# EasyEDA schematic phantom_sch.json
TITLE: Adaptador NES - Phantom; REV: 1.0; Date: 2025-06-09; Sheet: 1/1; Drawn By: robertofelix; Company: AidentuNet
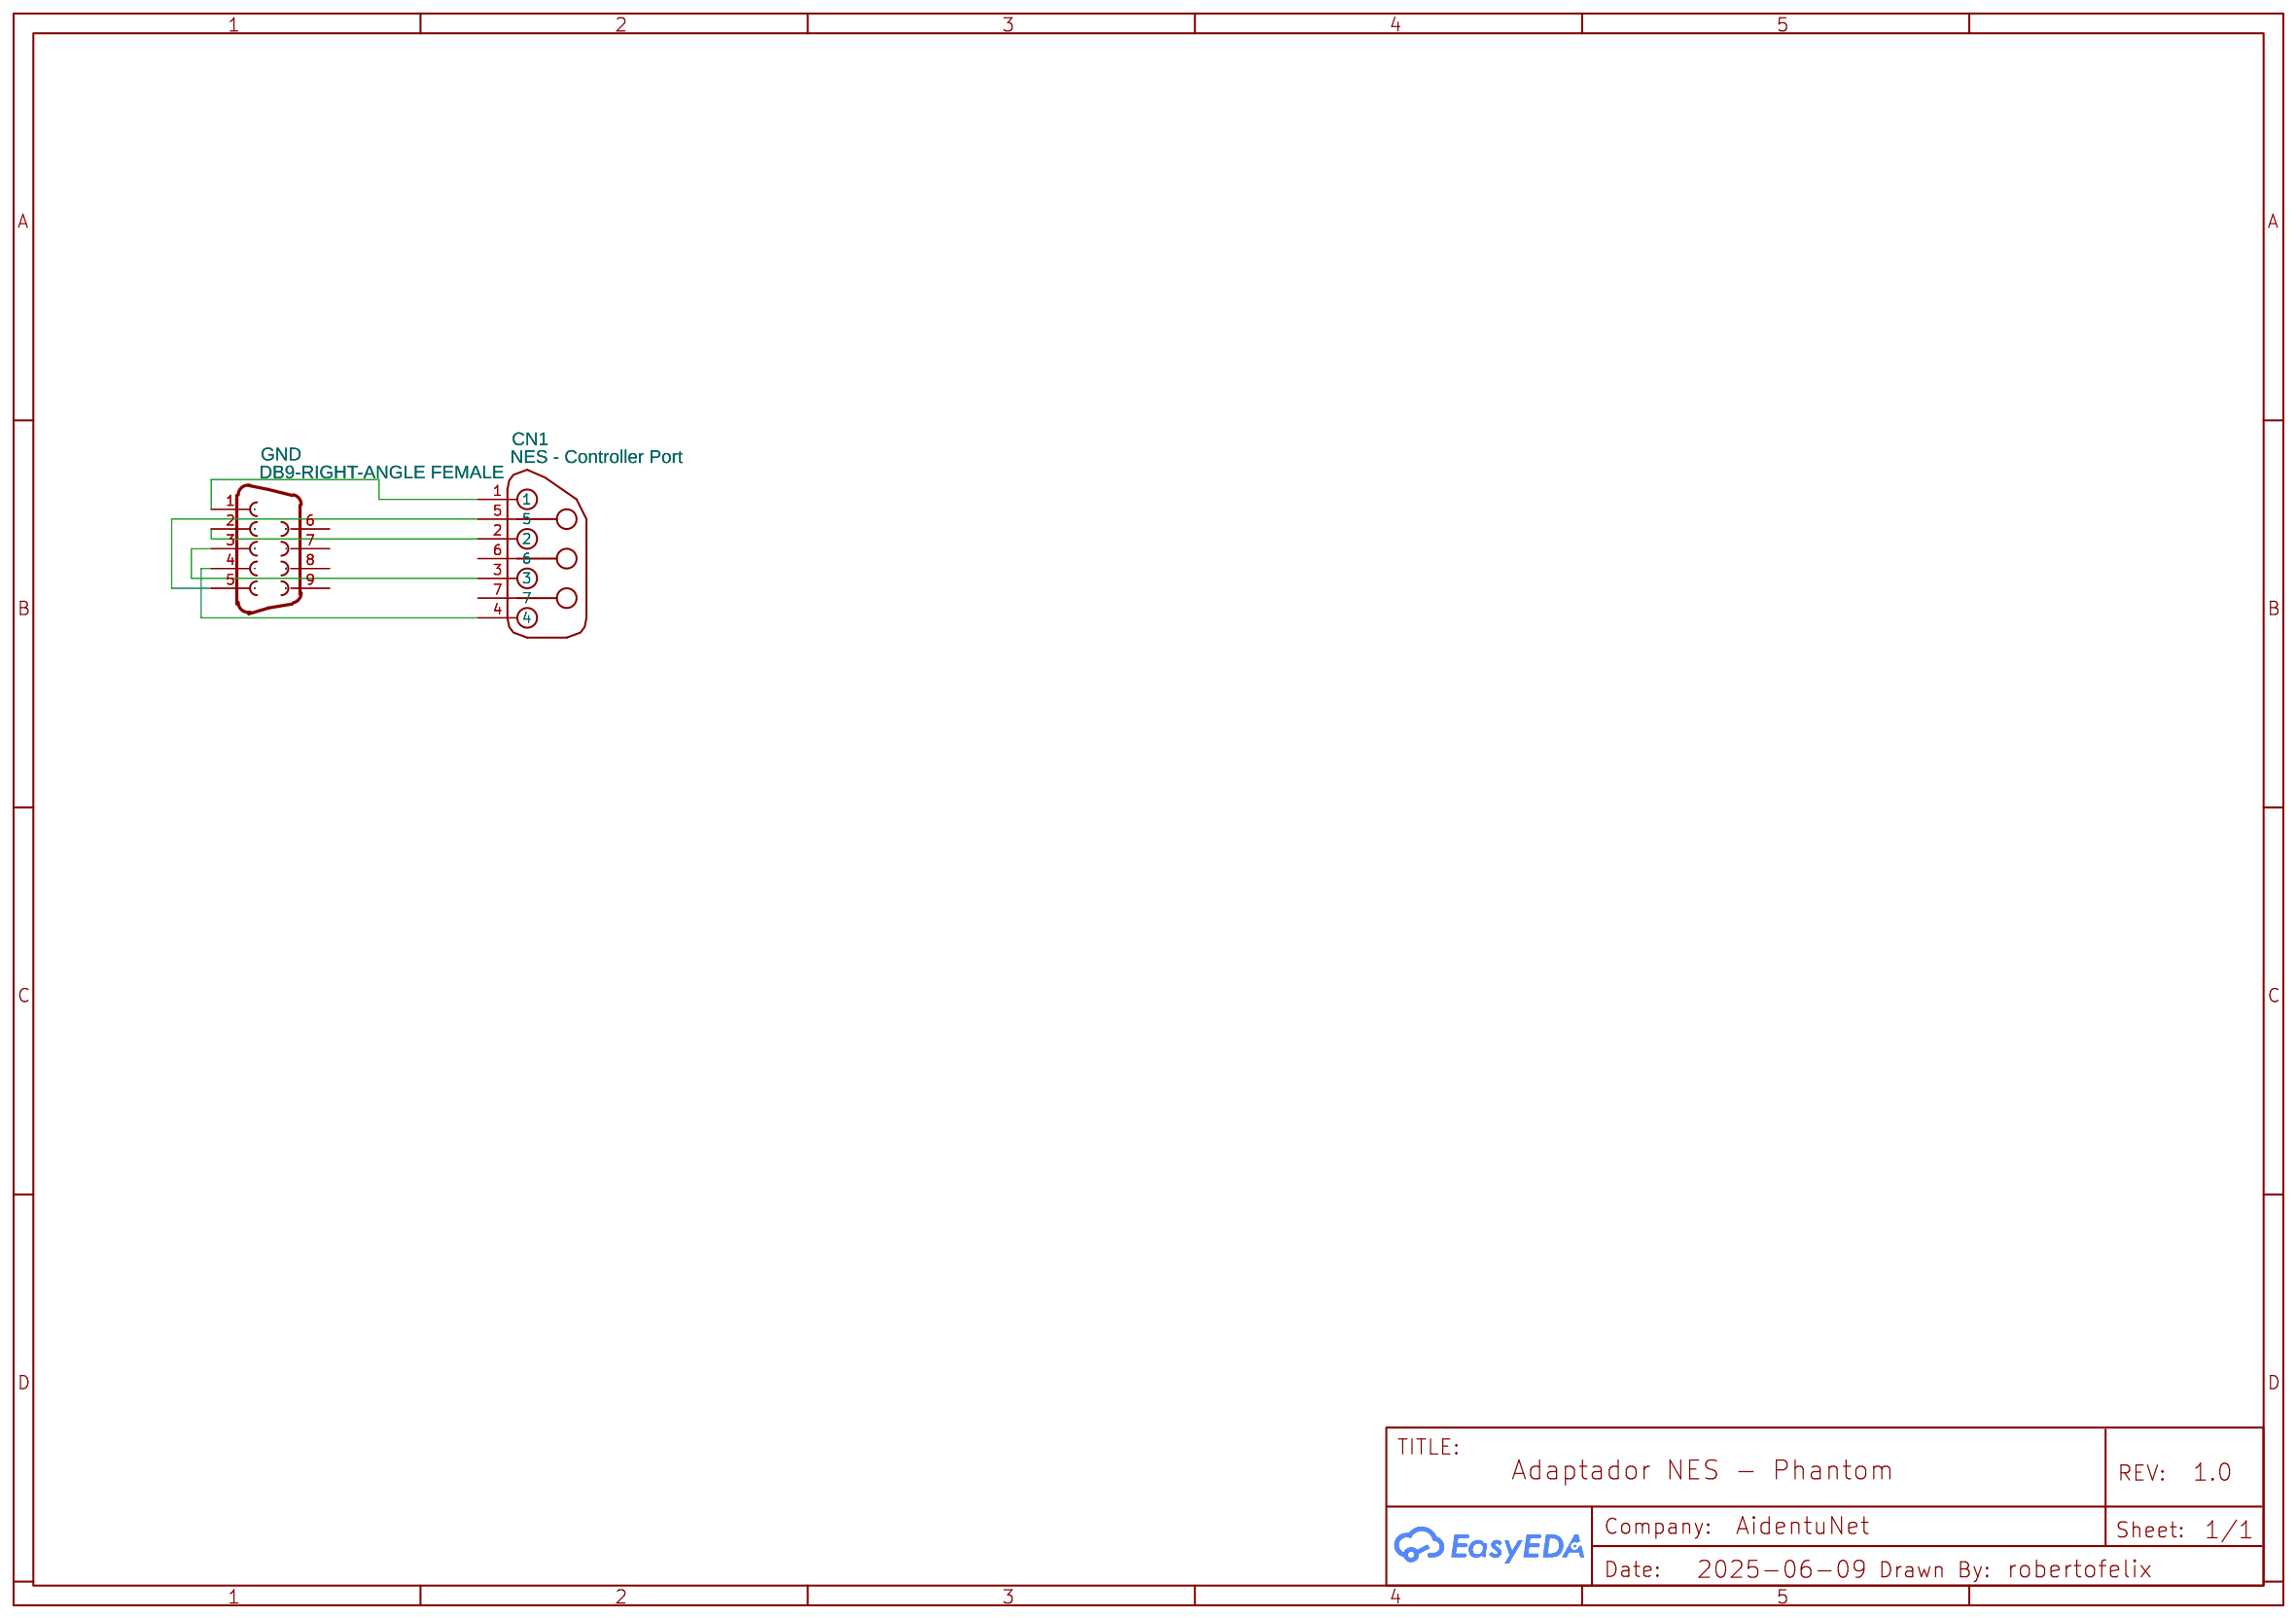
[diagram p0: schematic sheet]

## Parts
CN1  NES - Controller Port  [NES CONTROLLER 7 PIN FEMALE CONNECTOR WITH MOUNT PEGS]
GND  DB9-RIGHT-ANGLE FEMALE  [DB9-RIGHT-ANGLE FEMALE]

## Library data of the parts
CN1 = NES - Controller Port: Supplier: Raphnet; Supplier Part: CONN-NES-V; link: https://www.raphnet-tech.com/products/nes_controller_connector/index.php; Contributor: vejymonsta
GND = DB9-RIGHT-ANGLE FEMALE: Contributor: hernandos

## Nets
Net-(CN1-1): CN1.1 GND.1
Net-(CN1-2): CN1.2 GND.2
Net-(CN1-3): CN1.3 GND.3
Net-(CN1-4): CN1.4 GND.4
Net-(CN1-5): CN1.5 GND.5

Not connected (* = marked no-connect by the designer): CN1 6 7; GND 6 7 8 9
